# Altium schematic sheet COMMS.SchDoc
size A3; SheetNumber: 4; SheetTotal: 5
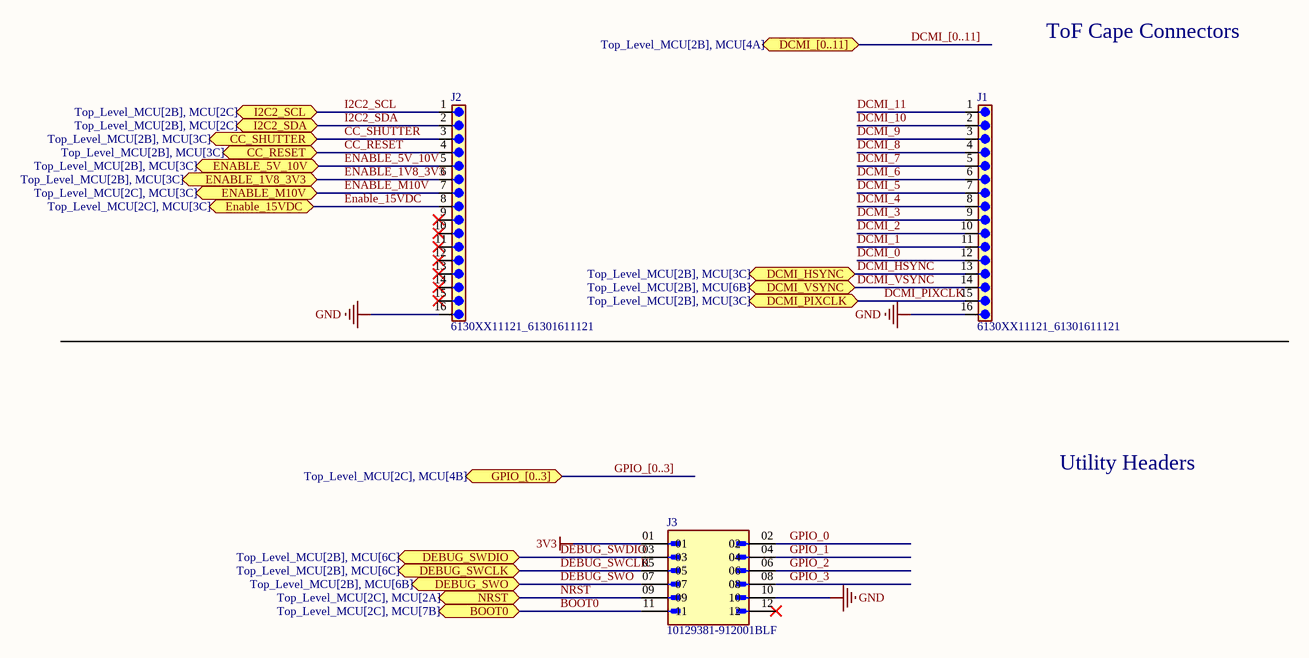
[diagram p0: COMMS.SchDoc]

## Parts
J1  6130XX11121_61301611121  [61301611121]
J2  6130XX11121_61301611121  [61301611121]
J3  10129381-912001BLF  [AMPHENOL_10129381-912001BLF]

## Ports
BOOT0 (bidir, see Top_Level_MCU[2C], MCU[7B]), CC_RESET (bidir, see Top_Level_MCU[2B], MCU[3C]), CC_SHUTTER (bidir, see Top_Level_MCU[2B], MCU[3C]), DCMI_[0..11] (bidir, see Top_Level_MCU[2B], MCU[4A]), DCMI_HSYNC (bidir, see Top_Level_MCU[2B], MCU[3C]), DCMI_PIXCLK (bidir, see Top_Level_MCU[2B], MCU[3C]), DCMI_VSYNC (bidir, see Top_Level_MCU[2B], MCU[6B]), DEBUG_SWCLK (bidir, see Top_Level_MCU[2B], MCU[6C]), DEBUG_SWDIO (bidir, see Top_Level_MCU[2B], MCU[6C]), DEBUG_SWO (bidir, see Top_Level_MCU[2B], MCU[6B]), ENABLE_1V8_3V3 (bidir, see Top_Level_MCU[2B], MCU[3C]), ENABLE_5V_10V (bidir, see Top_Level_MCU[2B], MCU[3C]), Enable_15VDC (bidir, see Top_Level_MCU[2C], MCU[3C]), ENABLE_M10V (bidir, see Top_Level_MCU[2C], MCU[3C]), GPIO_[0..3] (bidir, see Top_Level_MCU[2C], MCU[4B]), I2C2_SCL (bidir, see Top_Level_MCU[2B], MCU[2C]), I2C2_SDA (bidir, see Top_Level_MCU[2B], MCU[2C]), NRST (bidir, see Top_Level_MCU[2C], MCU[2A])

## Nets
3V3: J3.01
GND: J1.16 J2.16 J3.10
BOOT0: J3.11 ; port BOOT0
CC_RESET: J2.4 ; port CC_RESET
CC_SHUTTER: J2.3 ; port CC_SHUTTER
DCMI_0: J1.12
DCMI_1: J1.11
DCMI_2: J1.10
DCMI_3: J1.9
DCMI_4: J1.8
DCMI_5: J1.7
DCMI_6: J1.6
DCMI_7: J1.5
DCMI_8: J1.4
DCMI_9: J1.3
DCMI_10: J1.2
DCMI_11: J1.1
DCMI_HSYNC: J1.13 ; port DCMI_HSYNC
DCMI_PIXCLK: J1.15 ; port DCMI_PIXCLK
DCMI_VSYNC: J1.14 ; port DCMI_VSYNC
DEBUG_SWCLK: J3.05 ; port DEBUG_SWCLK
DEBUG_SWDIO: J3.03 ; port DEBUG_SWDIO
DEBUG_SWO: J3.07 ; port DEBUG_SWO
ENABLE_1V8_3V3: J2.6 ; port ENABLE_1V8_3V3
ENABLE_5V_10V: J2.5 ; port ENABLE_5V_10V
Enable_15VDC: J2.8 ; port Enable_15VDC
ENABLE_M10V: J2.7 ; port ENABLE_M10V
GPIO_0: J3.02
GPIO_1: J3.04
GPIO_2: J3.06
GPIO_3: J3.08
I2C2_SCL: J2.1 ; port I2C2_SCL
I2C2_SDA: J2.2 ; port I2C2_SDA
NRST: J3.09 ; port NRST

Not connected (* = marked no-connect by the designer): J2 9* 10* 11* 12* 13* 14* 15*; J3 12*

## Buses and harness runs
bus DCMI_[0..11] = port DCMI_[0..11]
bus GPIO_[0..3] = port GPIO_[0..3]

## Notes on the sheet
- ToF Cape Connectors
- Utility Headers

## Library data of the parts
J1 J2 = 6130XX11121_61301611121: MF: {'manufacturer': u'Wurth Electronics'}; Package: None; Price: None; Value: *; MP: 61301611121; Availability: Unavailable
J3 = 10129381-912001BLF: EconoStikâ„¢, Board to Board connector, Unshrouded Vertical Header, Through Hole, Double Row, 12 Positions, 2.54 mm (0.100in) Pitch.; MF: Amphenol ICC (FCI); Check_prices: https://www.snapeda.com/parts/10129381-912001BLF/Amphenol+FCI/view-part/?ref=eda; SnapEDA_Link: https://www.snapeda.com/parts/10129381-912001BLF/Amphenol+FCI/view-part/?ref=snap; Value: *; Purchase-URL: https://pricing.snapeda.com/search/part/10129381-912001BLF/?ref=eda; Package: None; MP: 10129381-912001BLF; Digi-Key_Part_Number: 10129381-912001BLF-ND